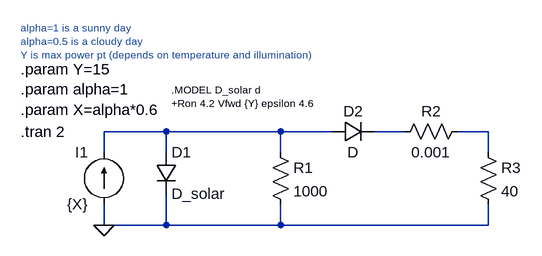
[diagram p0: schematic solar_panel_Rload.asc]
solar_panel_Rload.asc, the LTspice schematic file:
Version 4
SHEET 1 880 680
WIRE 128 128 32 128
WIRE 304 128 128 128
WIRE 384 128 304 128
WIRE 496 128 448 128
WIRE 624 128 576 128
WIRE 32 160 32 128
WIRE 128 160 128 128
WIRE 304 160 304 128
WIRE 624 160 624 128
WIRE 32 272 32 240
WIRE 128 272 128 224
WIRE 128 272 32 272
WIRE 304 272 304 240
WIRE 304 272 128 272
WIRE 624 272 624 240
WIRE 624 272 304 272
FLAG 32 272 0
SYMBOL res 288 144 R0
SYMATTR InstName R1
SYMATTR Value 1000
SYMBOL diode 112 160 R0
SYMATTR InstName D1
SYMATTR Value D_solar
SYMBOL current 32 240 R180
WINDOW 0 24 80 Left 2
WINDOW 3 24 0 Left 2
WINDOW 123 0 0 Left 2
WINDOW 39 0 0 Left 2
SYMATTR InstName I1
SYMATTR Value {X}
SYMBOL res 592 112 R90
WINDOW 0 0 56 VBottom 2
WINDOW 3 32 56 VTop 2
SYMATTR InstName R2
SYMATTR Value 0.001
SYMBOL diode 384 144 R270
WINDOW 0 32 32 VTop 2
WINDOW 3 0 32 VBottom 2
SYMATTR InstName D2
SYMBOL res 608 144 R0
SYMATTR InstName R3
SYMATTR Value 40
TEXT -96 128 Left 2 !.tran 2
TEXT 136 64 Left 1 !.MODEL D_solar d\n+Ron 4.2 Vfwd {Y} epsilon 4.6
TEXT -96 32 Left 2 !.param Y=15\n.param alpha=1\n.param X=alpha*0.6
TEXT -96 -32 Left 1 ;alpha=1 is a sunny day\nalpha=0.5 is a cloudy day\nY is max power pt (depends on temperature and illumination)

The netlist it stands for:
* solar_panel_Rload.asc
R1 N001 0 1000
D1 N001 0 D_solar
I1 0 N001 {X}
R2 N003 N002 0.001
D2 N001 N002 D
R3 N003 0 40
.model D D
.lib standard.dio
.tran 2
.MODEL D_solar d
+Ron 4.2 Vfwd {Y} epsilon 4.6
.param Y=15
.param alpha=1
.param X=alpha*0.6
* alpha=1 is a sunny day
* alpha=0.5 is a cloudy day
* Y is max power pt (depends on temperature and illumination)
.backanno
.end